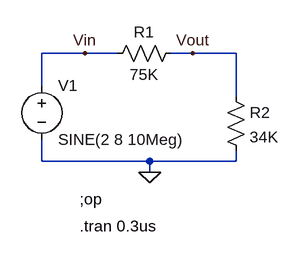
[diagram p0: schematic Draft2.asc]
Draft2.asc, the LTspice schematic file:
Version 4
SHEET 1 880 680
WIRE 112 128 48 128
WIRE 160 128 112 128
WIRE 272 128 240 128
WIRE 336 128 272 128
WIRE 48 176 48 128
WIRE 336 192 336 128
WIRE 48 288 48 256
WIRE 208 288 48 288
WIRE 336 288 336 272
WIRE 336 288 208 288
WIRE 208 304 208 288
FLAG 208 304 0
FLAG 112 128 Vin
FLAG 272 128 Vout
SYMBOL res 144 144 R270
WINDOW 0 32 56 VTop 2
WINDOW 3 0 56 VBottom 2
SYMATTR InstName R1
SYMATTR Value 75K
SYMBOL voltage 48 160 R0
WINDOW 123 0 0 Left 0
WINDOW 39 0 0 Left 0
SYMATTR InstName V1
SYMATTR Value SINE(2 8 10Meg)
SYMBOL res 320 176 R0
SYMATTR InstName R2
SYMATTR Value 34K
TEXT 104 344 Left 2 !;op
TEXT 104 384 Left 2 !.tran 0.3us

The netlist it stands for:
* Draft2.asc
R1 Vin Vout 75K
V1 Vin 0 SINE(2 8 10Meg)
R2 Vout 0 34K
;op
.tran 0.3us
.backanno
.end